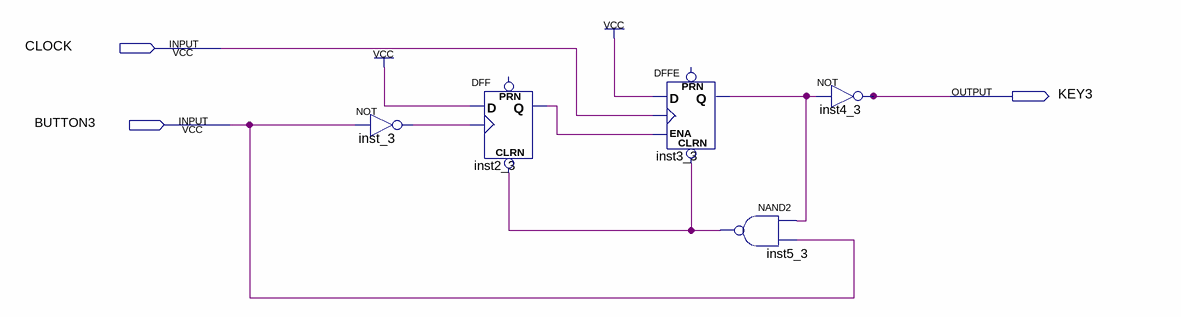
[diagram p0: schematic sheet]
// Quartus schematic Button_Debounce3.bdf as structural Verilog: 5 symbols, 3 pins
module Button_Debounce3 (
  input  CLOCK,
  input  BUTTON3,
  output KEY3
);

  wire inst2_3_q, inst3_3_q, inst5_3_out, inst_3_out;

  not inst_3 (inst_3_out, BUTTON3);
  DFF inst2_3 (.CLRN(inst5_3_out), .CLK(inst_3_out), .D(1'b1), .Q(inst2_3_q));  // open: PRN
  DFFE inst3_3 (.CLRN(inst5_3_out), .D(1'b1), .CLK(CLOCK), .ENA(inst2_3_q), .Q(inst3_3_q));  // open: PRN
  nand inst5_3 (inst5_3_out, inst3_3_q, BUTTON3);
  not inst4_3 (KEY3, inst3_3_q);
endmodule
